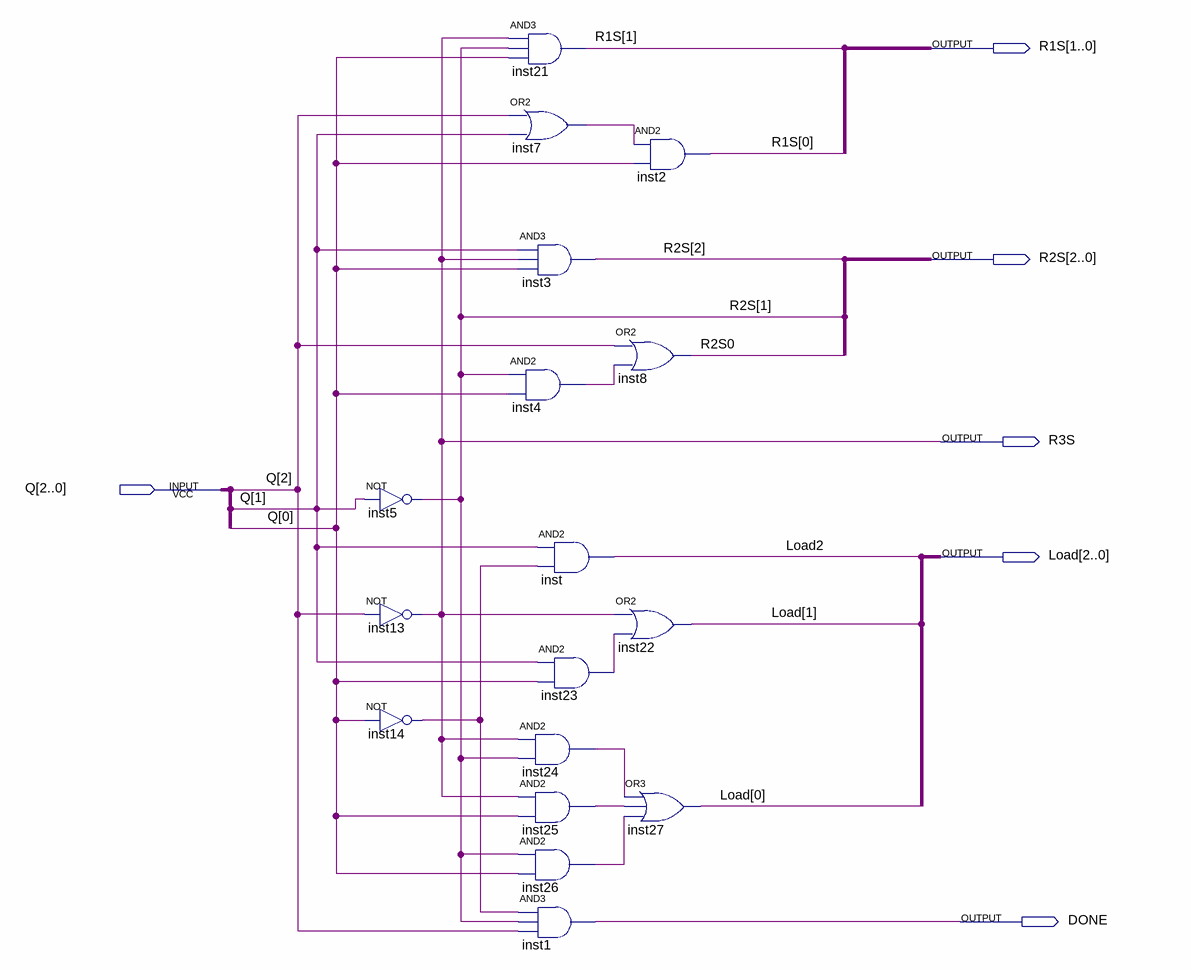
[diagram p0: schematic sheet]
// Quartus schematic OutputLogic.bdf as structural Verilog: 17 symbols, 6 pins
module OutputLogic (
  input  [2:0] Q,
  output [1:0] R1S,
  output [2:0] R2S,
  output R3S,
  output [2:0] Load,
  output DONE
);

  wire inst4_out, inst7_out, inst14_out, inst23_out, inst24_out, inst25_out, inst26_out;

  not inst5 (R2S[1], Q[1]);
  not inst13 (R3S, Q[2]);
  not inst14 (inst14_out, Q[0]);
  and inst21 (R1S[1], R3S, R2S[1], Q[0]);
  or inst7 (inst7_out, Q[2], Q[1]);
  and inst3 (R2S[2], Q[1], R3S, Q[0]);
  and inst4 (inst4_out, R2S[1], Q[0]);
  and inst (Load[2], Q[1], inst14_out);
  and inst23 (inst23_out, Q[1], Q[0]);
  and inst24 (inst24_out, R3S, R2S[1]);
  and inst25 (inst25_out, R3S, Q[0]);
  and inst26 (inst26_out, R2S[1], Q[0]);
  and inst1 (DONE, inst14_out, R2S[1], Q[2]);
  or inst8 (R2S[0], Q[2], inst4_out);
  or inst22 (Load[1], R3S, inst23_out);
  or inst27 (Load[0], inst24_out, inst25_out, inst26_out);
  and inst2 (R1S[0], inst7_out, Q[0]);
endmodule
